# Altium schematic sheet X-LaserPCB.SchDoc
size Tabloid; SheetNumber: 1; SheetTotal: 2; SheetDesc: <SheetDesc>
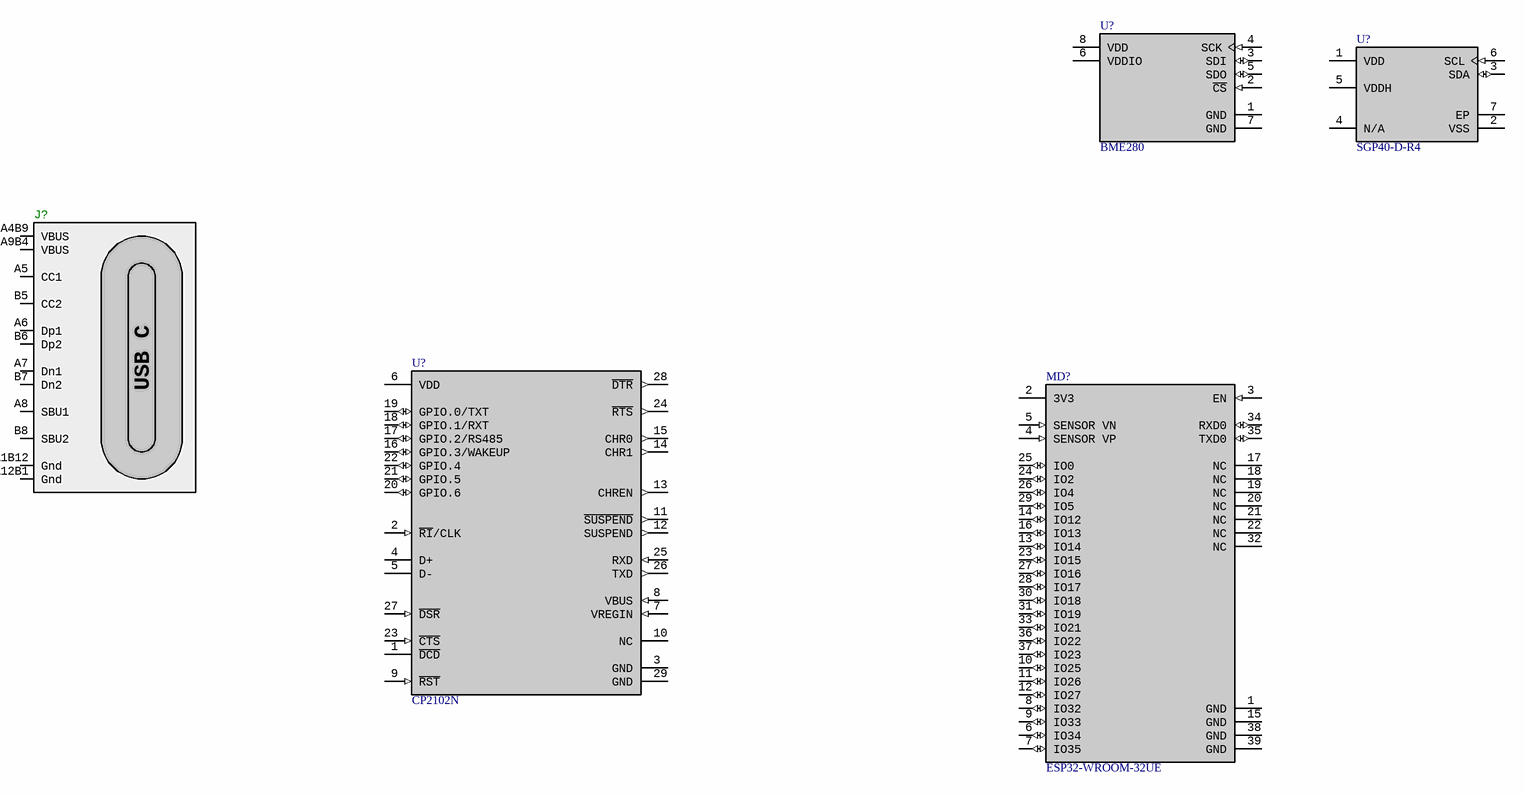
[diagram p0: X-LaserPCB.SchDoc]

## Parts
(Parts that share a designator on the sheet are numbered #1, #2 ... from top to bottom, then left to right.)
J?  (no value)  [2171790001]
MD?  ESP32-WROOM-32UE  [FP-ESP32-WROOM-32UE_4MB-MFG]
U?#1  BME280  [FP-BME280-MFG]
U?#2  SGP40-D-R4  [FP-SGP40-D-R4-IPC_A]
U?#3  CP2102N  [FP-CP2102N-A01-GQFN28-IPC_C]

## Nets

Not connected (* = marked no-connect by the designer): J? A1B12(Gnd) A4B9(VBUS) A5(CC1) A6(Dp1) A7(Dn1) A8(SBU1) A9B4(VBUS) A12B1(Gnd) B5(CC2) B6(Dp2) B7(Dn2) B8(SBU2); MD? 1(GND) 2(3V3) 3(EN) 4(SENSOR_VP) 5(SENSOR_VN) 6(IO34) 7(IO35) 8(IO32) 9(IO33) 10(IO25) 11(IO26) 12(IO27) 13(IO14) 14(IO12) 15(GND) 16(IO13) 17(NC) 18(NC) 19(NC) 20(NC) 21(NC) 22(NC) 23(IO15) 24(IO2) 25(IO0) 26(IO4) 27(IO16) 28(IO17) 29(IO5) 30(IO18) 31(IO19) 32(NC) 33(IO21) 34(RXD0) 35(TXD0) 36(IO22) 37(IO23) 38(GND) 39(GND); U?#1 1(GND) 2(~{CS}) 3(SDI) 4(SCK) 5(SDO) 6(VDDIO) 7(GND) 8(VDD); U?#2 1(VDD) 2(VSS) 3(SDA) 4(N/A) 5(VDDH) 6(SCL) 7(EP); U?#3 1(~{DCD}) 2(~{RI}/CLK) 3(GND) 4(D+) 5(D-) 6(VDD) 7(VREGIN) 8(VBUS) 9(~{RST}) 10(NC) 11(~{SUSPEND}) 12(SUSPEND) 13(CHREN) 14(CHR1) 15(CHR0) 16(GPIO.3/WAKEUP) 17(GPIO.2/RS485) 18(GPIO.1/RXT) 19(GPIO.0/TXT) 20(GPIO.6) 21(GPIO.5) 22(GPIO.4) 23(~{CTS}) 24(~{RTS}) 25(RXD) 26(TXD) 27(~{DSR}) 28(~{DTR}) 29(GND)

## Notes on the sheet
- Status Stamp
- DPN:
- PN:
- Drawn By:
- Description:
- Checked by:
- The information contained in this drawing is the sole property of X-Laser, LLC.  Any reproduction or distribution in part or as a whole is prohibited without the written permission of X-Laser, LLC
- Sheet:
- of:
- Date:
- Rev:
- (in symbol 385[[/\]]Con) USB C

## Library data of the parts
J? = 385[[/\]]Con: Horizontal Top Mount 16-Pin USB2.0 C Connector; MfrPns: Molex: 2171790001;; TID: Con; ID: 385; Subtype: C Receptcale; XLPN: 130-402; UOM: ea; UID: 1465; Type: USB; Subtype2: Horizontal Top Mount
MD? = ESP32-WROOM-32UE-4: WiFi-Modul 802.11/BT 2, 4-2, 5GHz 150Mb/s
U?#1 = BME280-1: SENSOR PRESSURE HUMIDITY TEMP
U?#2 = SGP40-1: Multi Gas Sensor; Reach SVHC Compliant: Yes
U?#3 = CP2102N-2: USB Bus Controller, CMOS; Max Supply Voltage: 3.6V; Nominal Supply Voltage: 3.3V; Min Supply Voltage: 3V; RoHS Compliant: Yes; Terminal Pitch: 0.5mm; Terminal Position: QUAD; Length: 5mm; Width: 5mm; Technology: CMOS; Pins: 28; Package Style: CHIP CARRIER, HEAT SINK/SLUG, VERY THIN PROFILEMeter; Terminal Form: No Lead; Reach SVHC Compliant: Yes; Height - Seated (Max): 0.8mm; Surface Mount: Yes; Temperature Grade: INDUSTRIAL; Case/Package: HVQCCN; Min Operating Temperature: -40°C; Max Operating Temperature: 85°C; Package Shape: Square